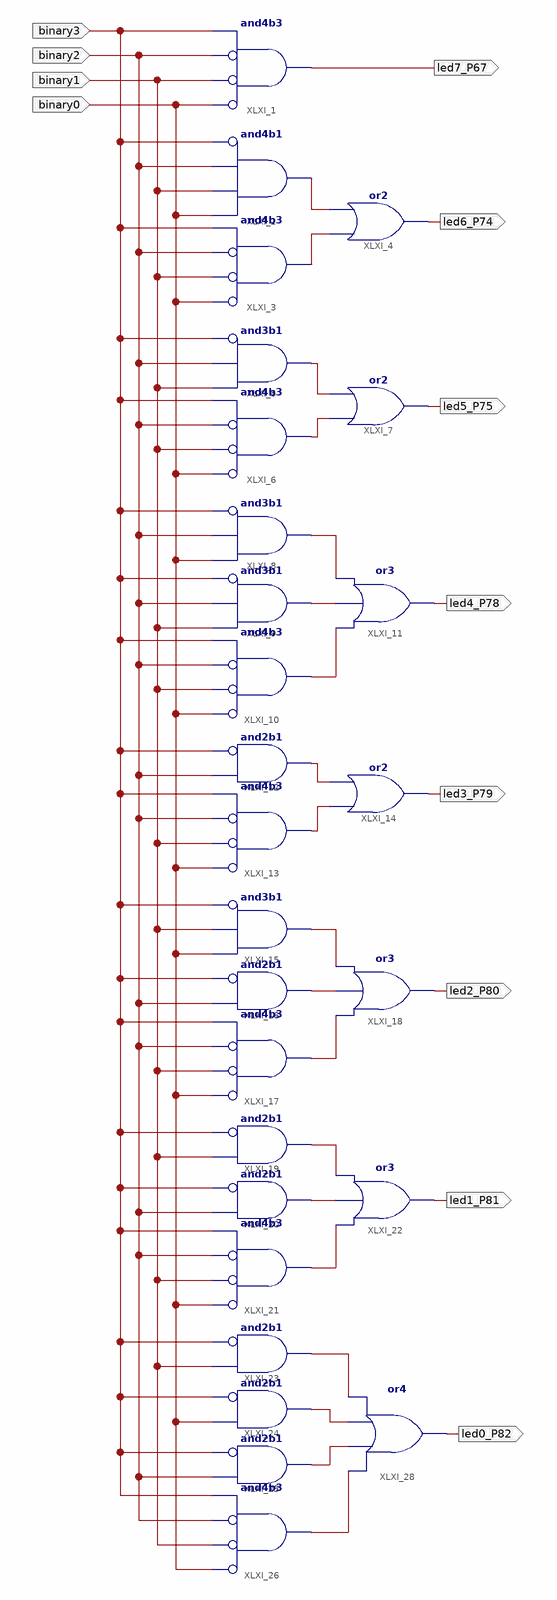
[diagram p0: schematic sheet 1]
// Xilinx ISE schematic lab9_201_led.sch (spartan6) as structural Verilog: 27 symbols, 12 ports
module lab9_201_led (
  input  binary3,
  input  binary1,
  input  binary2,
  input  binary0,
  output led7_P67,
  output led6_P74,
  output led5_P75,
  output led4_P78,
  output led3_P79,
  output led2_P80,
  output led1_P81,
  output led0_P82
);

  wire XLXN_2, XLXN_3, XLXN_5, XLXN_6, XLXN_8, XLXN_9, XLXN_10, XLXN_12, XLXN_13, XLXN_15, XLXN_16, XLXN_17,
       XLXN_19, XLXN_20, XLXN_21, XLXN_23, XLXN_24, XLXN_25, XLXN_26;

  and XLXI_1 (led7_P67, ~binary0, ~binary1, ~binary2, binary3);  // and4b3
  and XLXI_2 (XLXN_2, ~binary3, binary2, binary1, binary0);  // and4b1
  and XLXI_3 (XLXN_3, ~binary0, ~binary1, ~binary2, binary3);  // and4b3
  or XLXI_4 (led6_P74, XLXN_3, XLXN_2);
  and XLXI_5 (XLXN_5, ~binary3, binary2, binary1);  // and3b1
  and XLXI_6 (XLXN_6, ~binary0, ~binary1, ~binary2, binary3);  // and4b3
  or XLXI_7 (led5_P75, XLXN_6, XLXN_5);
  and XLXI_8 (XLXN_8, ~binary3, binary2, binary0);  // and3b1
  and XLXI_9 (XLXN_9, ~binary3, binary2, binary1);  // and3b1
  and XLXI_10 (XLXN_10, ~binary0, ~binary1, ~binary2, binary3);  // and4b3
  or XLXI_11 (led4_P78, XLXN_10, XLXN_9, XLXN_8);
  and XLXI_12 (XLXN_12, ~binary3, binary2);  // and2b1
  and XLXI_13 (XLXN_13, ~binary0, ~binary1, ~binary2, binary3);  // and4b3
  or XLXI_14 (led3_P79, XLXN_13, XLXN_12);
  and XLXI_15 (XLXN_17, ~binary3, binary1, binary0);  // and3b1
  and XLXI_16 (XLXN_15, ~binary3, binary2);  // and2b1
  and XLXI_17 (XLXN_16, ~binary0, ~binary1, ~binary2, binary3);  // and4b3
  or XLXI_18 (led2_P80, XLXN_16, XLXN_15, XLXN_17);
  and XLXI_19 (XLXN_20, ~binary3, binary1);  // and2b1
  and XLXI_20 (XLXN_19, ~binary3, binary2);  // and2b1
  and XLXI_21 (XLXN_21, ~binary0, ~binary1, ~binary2, binary3);  // and4b3
  or XLXI_22 (led1_P81, XLXN_21, XLXN_19, XLXN_20);
  and XLXI_23 (XLXN_23, ~binary3, binary1);  // and2b1
  and XLXI_24 (XLXN_24, ~binary3, binary0);  // and2b1
  and XLXI_25 (XLXN_25, ~binary3, binary2);  // and2b1
  and XLXI_26 (XLXN_26, ~binary0, ~binary1, ~binary2, binary3);  // and4b3
  or XLXI_28 (led0_P82, XLXN_26, XLXN_25, XLXN_24, XLXN_23);
endmodule
